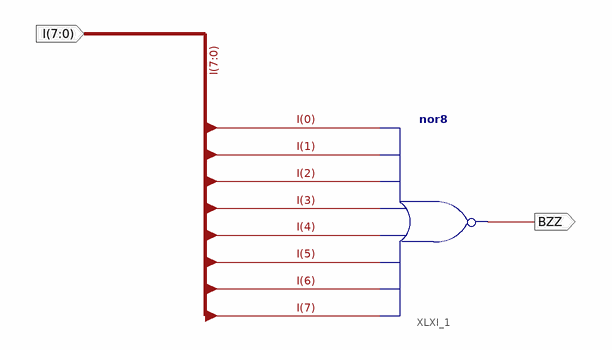
[diagram p0: schematic sheet 1]
// Xilinx ISE schematic Buzzer.sch (spartan6) as structural Verilog: 1 symbols, 2 ports
module Buzzer (
  input  [7:0] I,
  output BZZ
);

  nor XLXI_1 (BZZ, I[7], I[6], I[5], I[4], I[3], I[2], I[1], I[0]);
endmodule
